# Altium schematic sheet Demo CW6655A SSOP20 BLE V1.2.SchDoc
size A4
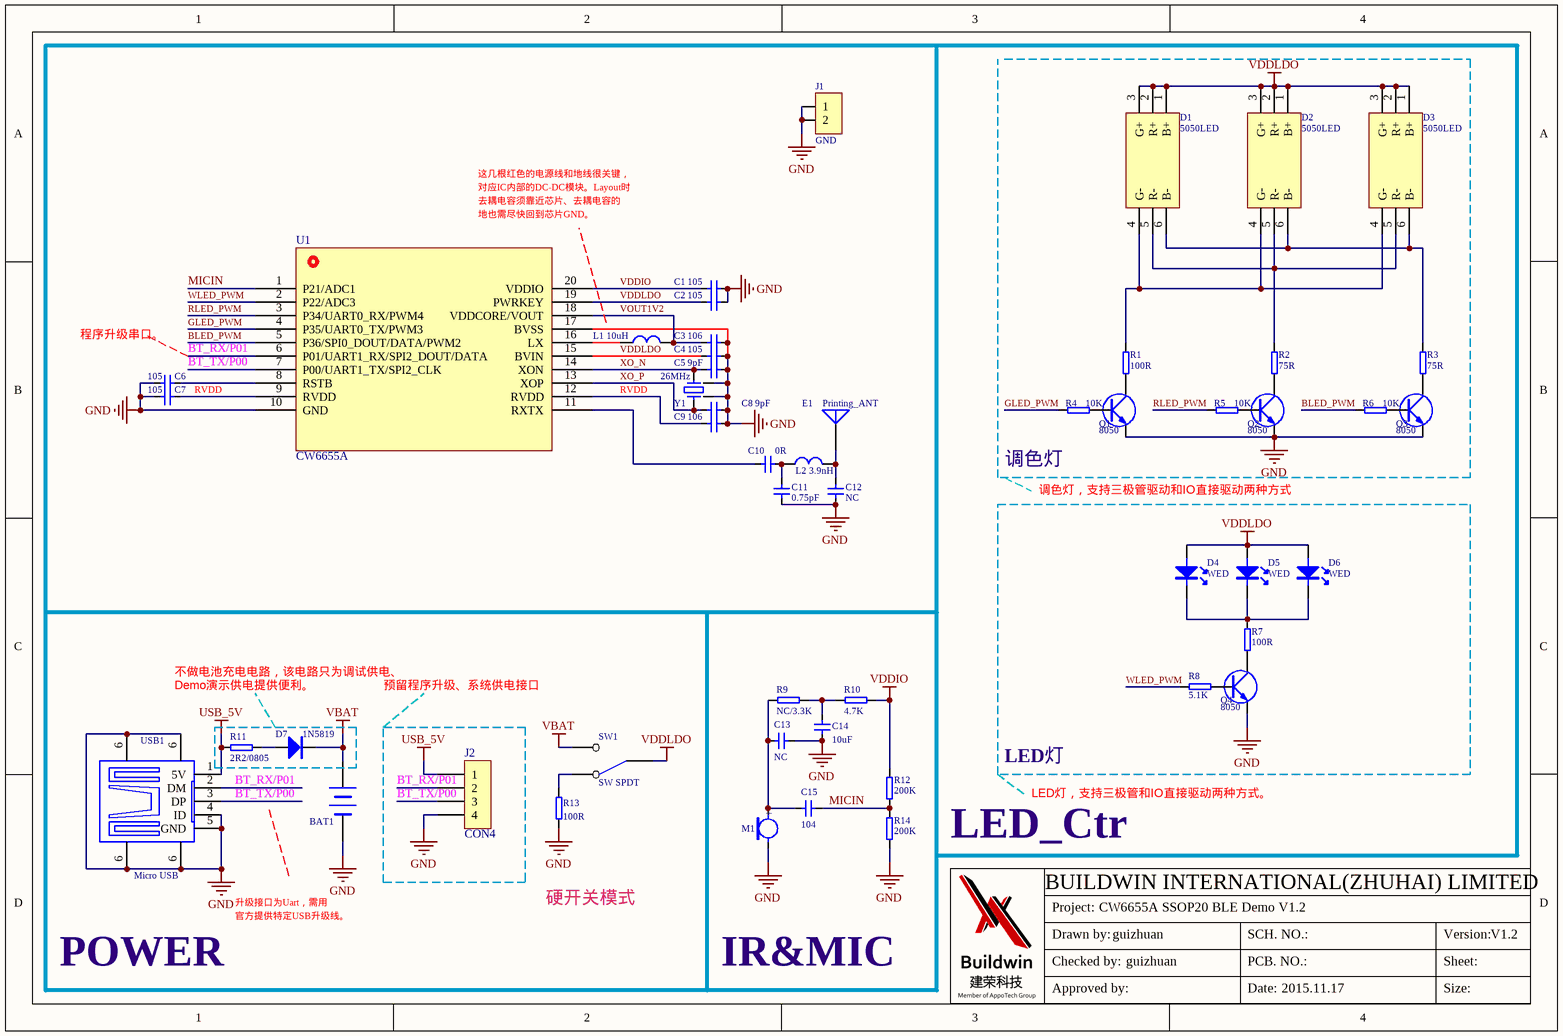
[diagram p0: Demo CW6655A SSOP20 BLE V1.2.SchDoc]

## Parts
BAT1  排针  [sip2]  (value not drawn)
C1  105  [C0603]
C2  105  [C0603]
C3  106  [C0805]
C4  105  [C0603]
C5  9pF  [C0603]
C6  105  [c0603]
C7  105  [C0603]
C8  9pF  [C0603]
C9  106  [C0603]
C10  0R  [c0603]
C11  0.75pF  [C0603]
C12  NC  [C0603]
C13  NC  [C0603]
C14  10uF  [C0805]
C15  104  [C0603]
D1  5050LED  [5050LED]
D2  5050LED  [5050LED]
D3  5050LED  [5050LED]
D4  WED  [D3528]
D5  WED  [D3528]
D6  WED  [D3528]
D7  1N5819  [DO-214]
E1  Printing_ANT  [IFA]  (net tie, no BOM)
J1  GND  [SIP2]
J2  CON4  [SIP4]
L1  10uH  [L0805]
L2  3.9nH  [L0603]
M1  MIC  [MIC]  (value not drawn)
Q1  8050  [SOT-23]
Q2  8050  [SOT-23]
Q3  8050  [SOT-23]
Q4  8050  [SOT-23]
R1  100R  [R0603]
R2  75R  [R0603]
R3  75R  [R0603]
R4  10K  [R0603]
R5  10K  [R0603]
R6  10K  [R0603]
R7  100R  [R0603]
R8  5.1K  [R0603]
R9  NC/3.3K  [R0603]
R10  4.7K  [R0603]
R11  2R2/0805  [R0805]
R12  200K  [R0603]
R13  100R  [R0603]
R14  200K  [R0603]
SW1  SW SPDT  [SWWDIP]
U1  CW6655A  [SSOP_20L]
USB1  Micro USB  [USB-MICRO]  (net tie, no BOM)
Y1  26MHz  [26m]

## Blocks framed on the sheet
LED灯: D4-D6 Q4 R7 R8

## Nets
GND: BAT1.2(-) C1.1 C2.1 C3.1 C4.1 C5.1 C6.2 C7.2 C8.1 C9.1 C11.1 C12.1 C13.1 C14.1 J1.1 J1.2 J2.4 M1.2 Q1.2(E) Q2.2(E) Q3.2(E) Q4.2(E) R13.2 R14.1 U1.10(GND) U1.17(BVSS) USB1.4(ID) USB1.5(GND) USB1.6 Y1.2 Y1.4
USB_5V: J2.1 R11.1 USB1.1(5V)
VBAT: BAT1.1(+) D7.2(K) SW1.3(NO)
VDDIO: C1.2 R10.2 R12.2 U1.20(VDDIO)
VDDLDO: C2.2 C4.2 D1.1(B+) D1.2(R+) D1.3(G+) D2.1(B+) D2.2(R+) D2.3(G+) D3.1(B+) D3.2(R+) D3.3(G+) D4.1 D5.1 D6.1 SW1.1(COMMON) U1.15(BVIN) U1.19(PWRKEY)
BLED_PWM: R6.2 U1.5(P36/SPI0_DOUT/DATA/PWM2)
BT_RX/P01: J2.2 U1.6(P01/UART1_RX/SPI2_DOUT/DATA) USB1.2(DM)
BT_TX/P00: J2.3 U1.7(P00/UART1_TX/SPI2_CLK) USB1.3(DP)
GLED_PWM: R4.2 U1.4(P35/UART0_TX/PWM3)
MICIN: C15.1 R12.1 R14.2 U1.1(P21/ADC1)
RLED_PWM: R5.2 U1.3(P34/UART0_RX/PWM4)
RVDD: C7.1 C9.2 U1.9(RVDD) U1.12(RVDD)
VOUT1V2: C3.2 L1.2 U1.18(VDDCORE/VOUT)
WLED_PWM: R8.2 U1.2(P22/ADC3)
XO_N: C5.2 U1.14(XON) Y1.3
XO_P: C8.2 U1.13(XOP) Y1.1
NetC6_1: C6.1 U1.8(RSTB)
NetC10_1: C10.1 U1.11(RXTX)
NetC10_2: C10.2 C11.2 L2.1
NetC12_2: C12.2 E1.1(A) L2.2
NetC13_2: C13.2 C15.2 M1.1 R9.1
NetC14_2: C14.2 R9.2 R10.1
NetD1_4: D1.4(G-) D2.4(G-) D3.4(G-) R1.1
NetD1_5: D1.5(R-) D2.5(R-) D3.5(R-) R2.1
NetD1_6: D1.6(B-) D2.6(B-) D3.6(B-) R3.1
NetD4_2: D4.2 D5.2 D6.2 R7.2
NetD7_1: D7.1(A) R11.2
NetL1_1: L1.1 U1.16(LX)
NetQ1_1: Q1.1(B) R4.1
NetQ1_3: Q1.3(C) R1.2
NetQ2_1: Q2.1(B) R5.1
NetQ2_3: Q2.3(C) R2.2
NetQ3_1: Q3.1(B) R6.1
NetQ3_3: Q3.3(C) R3.2
NetQ4_1: Q4.1(B) R8.1
NetQ4_3: Q4.3(C) R7.1
NetR13_1: R13.1 SW1.2(NC)

## Notes on the sheet
- 这几根红色的电源线和地线很关键，
- 对应IC内部的DC-DC模块。Layout时
- 去耦电容须靠近芯片、去耦电容的
- 地也需尽快回到芯片GND。
- 程序升级串口。
- 调色灯
- 调色灯，支持三极管驱动和IO直接驱动两种方式
- 不做电池充电电路，该电路只为调试供电、
- Demo演示供电提供便利。
- 预留程序升级、系统供电接口
- LED_Ctr
- LED灯，支持三极管和IO直接驱动两种方式。
- 升级接口为Uart，需用
- 官方提供特定USB升级线。
- 硬开关模式
- BUILDWIN INTERNATIONAL(ZHUHAI) LIMITED
- Project:
- CW6655A SSOP20 BLE Demo V1.2
- POWER
- IR&MIC
- Drawn by:
- Checked by:
- guizhuan
- SCH. NO.:
- PCB. NO.:
- Version:
- Sheet:
- V1.2
- Approved by:
- Date:
- 2015.11.17
- Size:
- (in symbol MICROPHONE2) +

## Library data of the parts
BAT1 = BATTERY
C1-C15 = CAP: Capacitor
D4-D6 = LED
D7 = DIODE
E1 = Antenna: Generic Antenna; Published: 24-Mar-1999; LatestRevisionDate: 17-Jul-2002; LatestRevisionNote: Re-released for DXP Platform.; PackageReference: PIN1; Publisher: Altium Limited
J1 = CON2: Connector
J2 = CON4: Connector
L1 L2 = INDUCTOR
M1 = MICROPHONE2: Microphone
Q1-Q4 = NPN-SMD1: NPN Transistor
R1-R14 = RES2
SW1 = SW SPDT: pin to pad: 1>2 2>1
USB1 = Mini USB-F
Y1 = CRYSTAL